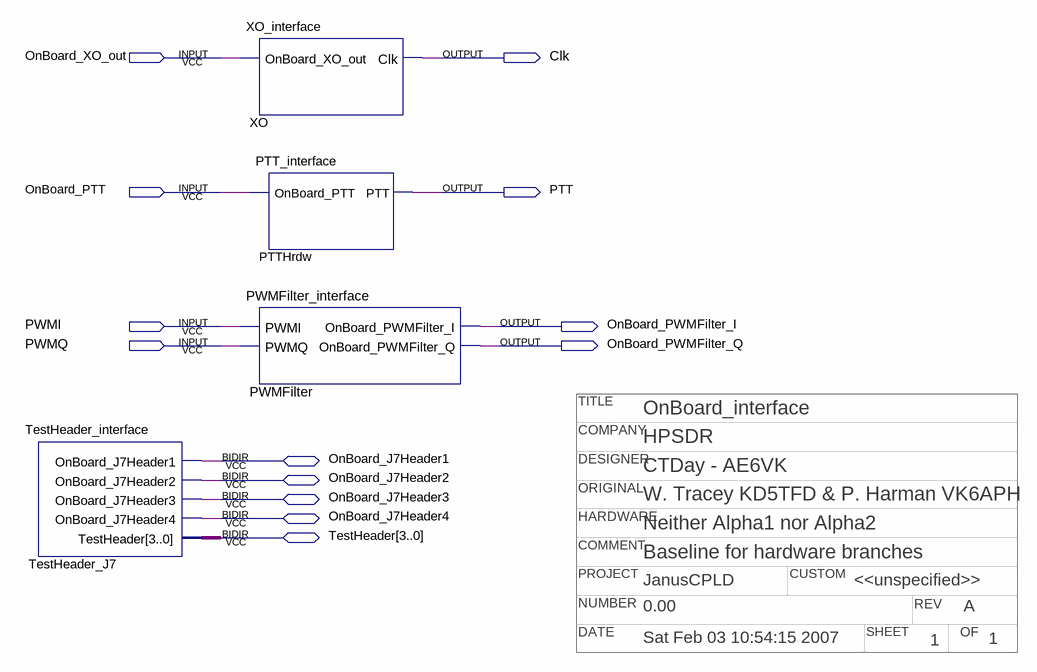
[diagram p0: schematic sheet]
// Quartus schematic OnBoard_interface.bdf as structural Verilog: 4 symbols, 13 pins
// Title block: TITLE: OnBoard_interface; COMPANY: HPSDR; DESIGNER: CTDay - AE6VK; NUMBER: 0.00; REV: A; DATE: Sat Feb 03 10:54:15 2007; SHEET: 1; OF: 1; ORIGINAL: W. Tracey KD5TFD & P. Harman VK6APH; HARDWARE: Neither Alpha1 nor Alpha2; COMMENT: Baseline for hardware branches; PROJECT: JanusCPLD; CUSTOM: <<unspecified>>
module OnBoard_interface (
  input  OnBoard_XO_out,
  input  OnBoard_PTT,
  input  PWMI,
  input  PWMQ,
  inout  OnBoard_J7Header1,
  inout  OnBoard_J7Header2,
  inout  OnBoard_J7Header3,
  inout  OnBoard_J7Header4,
  inout  [3:0] TestHeader,
  output Clk,
  output PTT,
  output OnBoard_PWMFilter_I,
  output OnBoard_PWMFilter_Q
);

  TestHeader_interface TestHeader_J7 (
    .OnBoard_J7Header1(OnBoard_J7Header1), .OnBoard_J7Header2(OnBoard_J7Header2),
    .OnBoard_J7Header3(OnBoard_J7Header3), .OnBoard_J7Header4(OnBoard_J7Header4), .TestHeader(TestHeader));
  XO_interface XO (.OnBoard_XO_out(OnBoard_XO_out), .Clk(Clk));
  PTT_interface PTTHrdw (.OnBoard_PTT(OnBoard_PTT), .PTT(PTT));
  PWMFilter_interface PWMFilter (
    .PWMI(PWMI), .PWMQ(PWMQ), .OnBoard_PWMFilter_I(OnBoard_PWMFilter_I),
    .OnBoard_PWMFilter_Q(OnBoard_PWMFilter_Q));
endmodule
